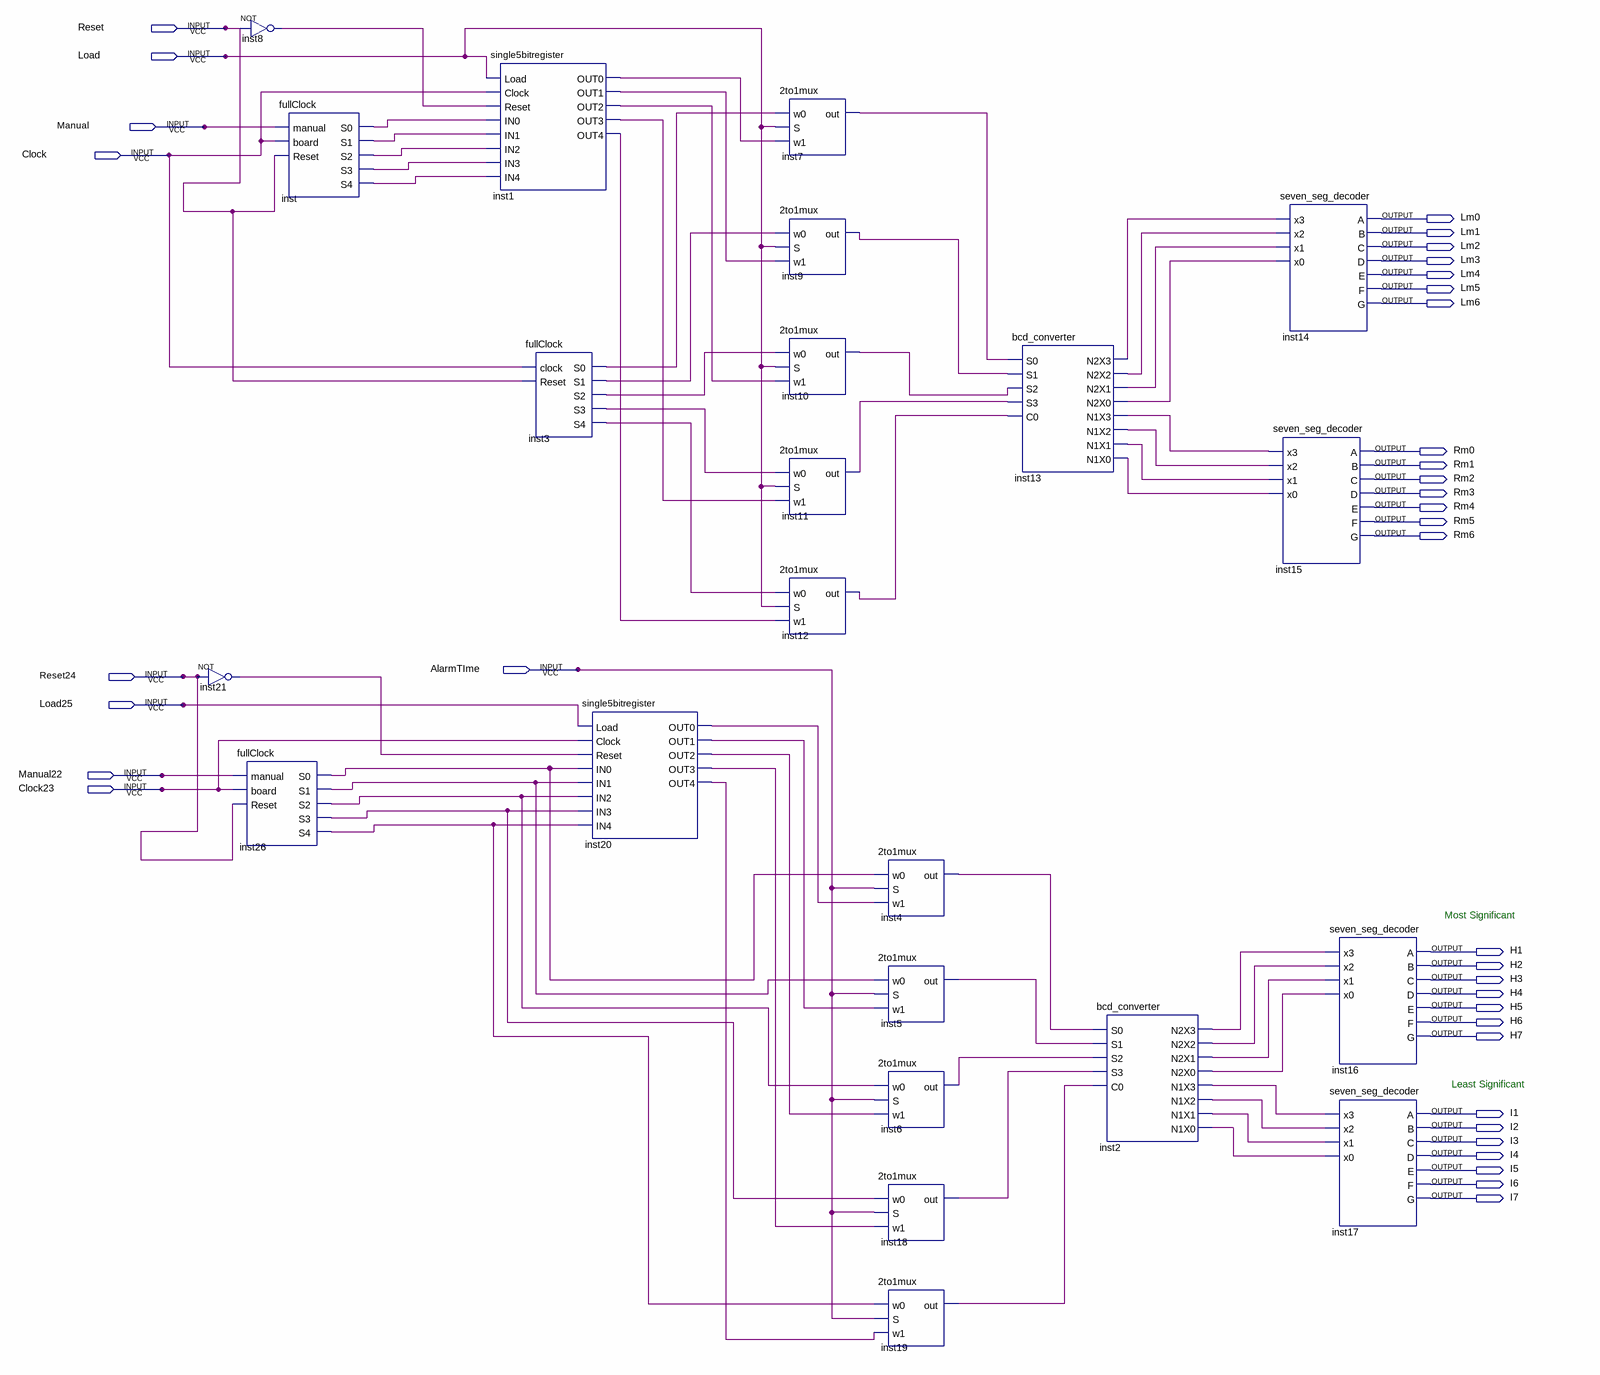
[diagram p0: schematic sheet]
// Quartus schematic alarmclockv1.bdf as structural Verilog: 23 symbols, 37 pins
module alarmclockv1 (
  input  Reset,
  input  Load,
  input  Manual,
  input  Clock,
  input  AlarmTIme,
  input  Reset24,
  input  Load25,
  input  Manual22,
  input  Clock23,
  output Lm0,
  output Lm1,
  output Lm2,
  output Lm3,
  output Lm4,
  output Lm5,
  output Lm6,
  output Rm0,
  output Rm1,
  output Rm2,
  output Rm3,
  output Rm4,
  output Rm5,
  output Rm6,
  output H1,
  output H2,
  output H3,
  output H4,
  output H5,
  output H6,
  output H7,
  output I1,
  output I2,
  output I3,
  output I4,
  output I5,
  output I6,
  output I7
);

  wire inst1_out0, inst1_out1, inst1_out2, inst1_out3, inst1_out4, inst2_n1x0, inst2_n1x1, inst2_n1x2,
       inst2_n1x3, inst2_n2x0, inst2_n2x1, inst2_n2x2, inst2_n2x3, inst3_s0, inst3_s1, inst3_s2, inst3_s3,
       inst3_s4, inst4_out, inst5_out, inst6_out, inst7_out, inst8_out, inst9_out, inst10_out, inst11_out,
       inst12_out, inst13_n1x0, inst13_n1x1, inst13_n1x2, inst13_n1x3, inst13_n2x0, inst13_n2x1, inst13_n2x2,
       inst13_n2x3, inst18_out, inst19_out, inst20_out0, inst20_out1, inst20_out2, inst20_out3, inst20_out4,
       inst21_out, inst26_s0, inst26_s1, inst26_s2, inst26_s3, inst26_s4, inst_s0, inst_s1, inst_s2, inst_s3,
       inst_s4;

  not inst21 (inst21_out, Reset24);
  not inst8 (inst8_out, Reset);
  fullClock inst26 (
    .manual(Manual22), .board(Clock23), .Reset(Reset24), .S0(inst26_s0), .S1(inst26_s1), .S2(inst26_s2),
    .S3(inst26_s3), .S4(inst26_s4));
  fullClock inst (
    .manual(Manual), .board(Clock), .Reset(Reset), .S0(inst_s0), .S1(inst_s1), .S2(inst_s2), .S3(inst_s3),
    .S4(inst_s4));
  single5bitregister inst1 (
    .Load(Load), .Clock(Clock), .Reset(inst8_out), .IN0(inst_s0), .IN1(inst_s1), .IN2(inst_s2),
    .IN3(inst_s3), .IN4(inst_s4), .OUT0(inst1_out0), .OUT1(inst1_out1), .OUT2(inst1_out2), .OUT3(inst1_out3),
    .OUT4(inst1_out4));
  fullClock inst3 (
    .clock(Clock), .Reset(Reset), .S0(inst3_s0), .S1(inst3_s1), .S2(inst3_s2), .S3(inst3_s3), .S4(inst3_s4));
  single5bitregister inst20 (
    .Load(Load25), .Clock(Clock23), .Reset(inst21_out), .IN0(inst26_s0), .IN1(inst26_s1), .IN2(inst26_s2),
    .IN3(inst26_s3), .IN4(inst26_s4), .OUT0(inst20_out0), .OUT1(inst20_out1), .OUT2(inst20_out2),
    .OUT3(inst20_out3), .OUT4(inst20_out4));
  \2to1mux  inst7 (.w0(inst3_s0), .S(Load), .w1(inst1_out0), .out(inst7_out));
  \2to1mux  inst9 (.w0(inst3_s1), .S(Load), .w1(inst1_out1), .out(inst9_out));
  \2to1mux  inst10 (.w0(inst3_s2), .S(Load), .w1(inst1_out2), .out(inst10_out));
  \2to1mux  inst11 (.w0(inst3_s3), .S(Load), .w1(inst1_out3), .out(inst11_out));
  \2to1mux  inst12 (.w0(inst3_s4), .S(Load), .w1(inst1_out4), .out(inst12_out));
  \2to1mux  inst4 (.w0(inst26_s0), .S(AlarmTIme), .w1(inst20_out0), .out(inst4_out));
  \2to1mux  inst5 (.w0(inst26_s1), .S(AlarmTIme), .w1(inst20_out1), .out(inst5_out));
  \2to1mux  inst6 (.w0(inst26_s2), .S(AlarmTIme), .w1(inst20_out2), .out(inst6_out));
  \2to1mux  inst18 (.w0(inst26_s3), .S(AlarmTIme), .w1(inst20_out3), .out(inst18_out));
  \2to1mux  inst19 (.w0(inst26_s4), .S(AlarmTIme), .w1(inst20_out4), .out(inst19_out));
  bcd_converter inst13 (
    .S0(inst7_out), .S1(inst9_out), .S2(inst10_out), .S3(inst11_out), .C0(inst12_out), .N2X3(inst13_n2x3),
    .N2X2(inst13_n2x2), .N2X1(inst13_n2x1), .N2X0(inst13_n2x0), .N1X3(inst13_n1x3), .N1X2(inst13_n1x2),
    .N1X1(inst13_n1x1), .N1X0(inst13_n1x0));
  bcd_converter inst2 (
    .S0(inst4_out), .S1(inst5_out), .S2(inst6_out), .S3(inst18_out), .C0(inst19_out), .N2X3(inst2_n2x3),
    .N2X2(inst2_n2x2), .N2X1(inst2_n2x1), .N2X0(inst2_n2x0), .N1X3(inst2_n1x3), .N1X2(inst2_n1x2),
    .N1X1(inst2_n1x1), .N1X0(inst2_n1x0));
  seven_seg_decoder inst15 (
    .x3(inst13_n1x3), .x2(inst13_n1x2), .x1(inst13_n1x1), .x0(inst13_n1x0), .A(Rm0), .B(Rm1), .C(Rm2),
    .D(Rm3), .E(Rm4), .F(Rm5), .G(Rm6));
  seven_seg_decoder inst14 (
    .x3(inst13_n2x3), .x2(inst13_n2x2), .x1(inst13_n2x1), .x0(inst13_n2x0), .A(Lm0), .B(Lm1), .C(Lm2),
    .D(Lm3), .E(Lm4), .F(Lm5), .G(Lm6));
  seven_seg_decoder inst16 (
    .x3(inst2_n2x3), .x2(inst2_n2x2), .x1(inst2_n2x1), .x0(inst2_n2x0), .A(H1), .B(H2), .C(H3), .D(H4),
    .E(H5), .F(H6), .G(H7));
  seven_seg_decoder inst17 (
    .x3(inst2_n1x3), .x2(inst2_n1x2), .x1(inst2_n1x1), .x0(inst2_n1x0), .A(I1), .B(I2), .C(I3), .D(I4),
    .E(I5), .F(I6), .G(I7));

  // Notes on the sheet:
  //   Most Significant
  //   Least Significant
endmodule
